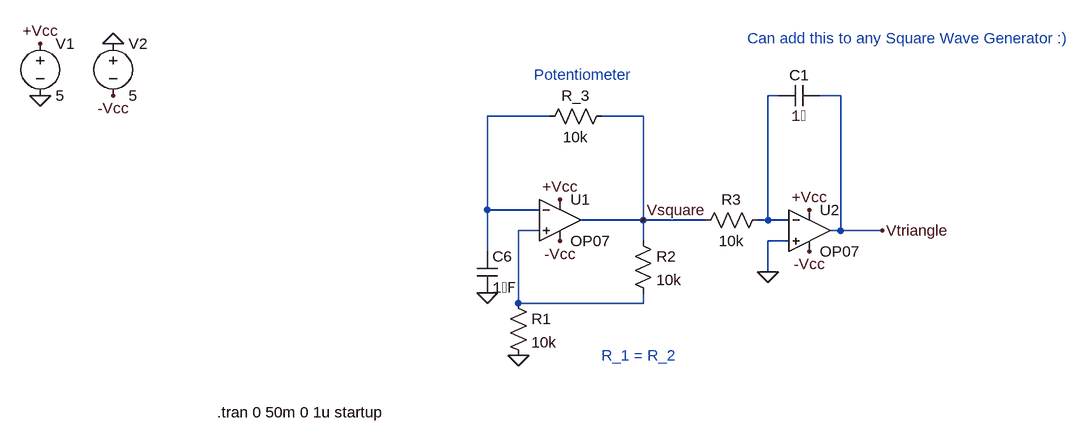
[diagram p0: schematic Triangle_wave_addition.asc]
Triangle_wave_addition.asc, the LTspice schematic file:
Version 4.1
SHEET 1 1520 1004
WIRE 800 -48 784 -48
WIRE 896 -48 864 -48
WIRE 448 -16 352 -16
WIRE 592 -16 528 -16
WIRE 352 128 352 -16
WIRE 432 128 352 128
WIRE 592 144 592 -16
WIRE 592 144 496 144
WIRE 688 144 592 144
WIRE 784 144 784 -48
WIRE 784 144 768 144
WIRE 816 144 784 144
WIRE 432 160 400 160
WIRE 896 160 896 -48
WIRE 896 160 880 160
WIRE 960 160 896 160
WIRE 592 176 592 144
WIRE 816 176 784 176
WIRE 352 192 352 128
WIRE 784 224 784 176
WIRE 400 272 400 160
WIRE 592 272 592 256
WIRE 592 272 400 272
FLAG 464 112 +Vcc
FLAG 464 176 -Vcc
FLAG -336 -48 0
FLAG -224 -128 0
FLAG -336 -128 +Vcc
FLAG -224 -48 -Vcc
FLAG 592 144 Vsquare
FLAG 352 256 0
FLAG 400 352 0
FLAG 784 224 0
FLAG 848 128 +Vcc
FLAG 848 192 -Vcc
FLAG 960 160 Vtriangle
SYMBOL voltage -336 -144 R0
SYMATTR InstName V1
SYMATTR Value 5
SYMBOL voltage -224 -144 R0
WINDOW 123 0 0 Left 0
WINDOW 39 0 0 Left 0
SYMATTR InstName V2
SYMATTR Value 5
SYMBOL cap 336 192 R0
SYMATTR InstName C6
SYMATTR Value 1�F
SYMBOL OpAmps\\OP07 464 80 R0
SYMATTR InstName U1
SYMBOL res 384 256 R0
SYMATTR InstName R1
SYMATTR Value 10k
SYMBOL res 576 160 R0
SYMATTR InstName R2
SYMATTR Value 10k
SYMBOL res 544 -32 R90
WINDOW 0 0 56 VBottom 2
WINDOW 3 32 56 VTop 2
SYMATTR InstName R_3
SYMATTR Value 10k
SYMBOL res 784 128 R90
WINDOW 0 0 56 VBottom 2
WINDOW 3 32 56 VTop 2
SYMATTR InstName R3
SYMATTR Value 10k
SYMBOL OpAmps\\OP07 848 96 R0
SYMATTR InstName U2
SYMBOL cap 864 -64 R90
WINDOW 0 0 32 VBottom 2
WINDOW 3 32 32 VTop 2
SYMATTR InstName C1
SYMATTR Value 1�
TEXT -64 440 Left 2 !.tran 0 50m 0 1u startup
TEXT 528 352 Left 2 ;R_1 = R_2
TEXT 424 -80 Left 2 ;Potentiometer
TEXT 752 -136 Left 2 ;Can add this to any Square Wave Generator :)

The netlist it stands for:
* Triangle_wave_addition.asc
V1 +Vcc 0 5
V2 0 -Vcc 5
C6 N002 0 1�F
X§U1 N003 N002 +Vcc -Vcc Vsquare LT1001  ; OP07, pins In+ In- V+ V- OUT
R1 N003 0 10k
R2 Vsquare N003 10k
R_3 Vsquare N002 10k
R3 N001 Vsquare 10k
X§U2 0 N001 +Vcc -Vcc Vtriangle LT1001  ; OP07, pins In+ In- V+ V- OUT
C1 Vtriangle N001 1�
.tran 0 50m 0 1u startup
* R_1 = R_2
* Potentiometer
* Can add this to any Square Wave Generator :)
.lib LTC.lib
.backanno
.end